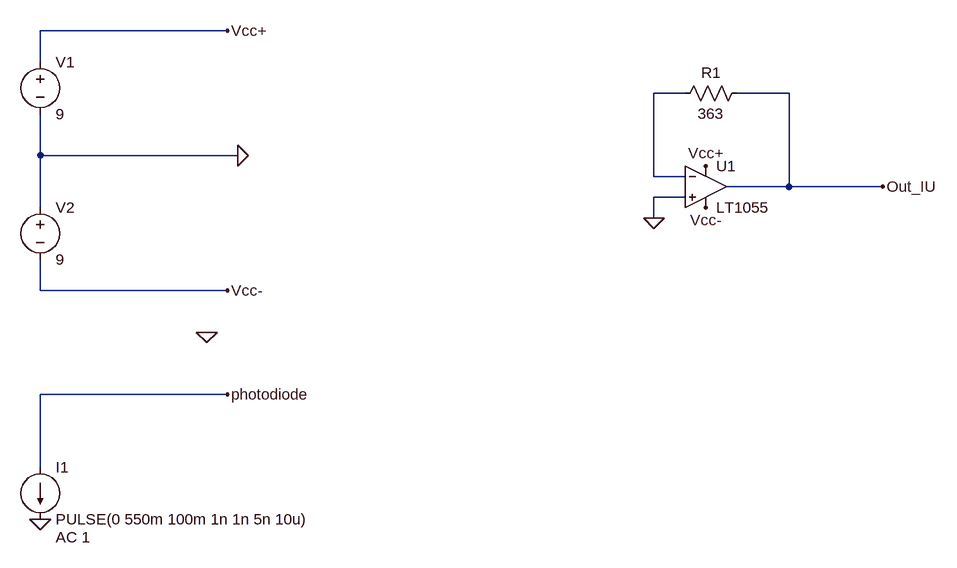
[diagram p0: schematic adaptation_d_impedance_seule.asc]
adaptation_d_impedance_seule.asc, the LTspice schematic file:
Version 4
SHEET 1 1144 680
WIRE 32 -464 -256 -464
WIRE -256 -416 -256 -464
WIRE 736 -368 688 -368
WIRE 896 -368 816 -368
WIRE -256 -272 -256 -336
WIRE 48 -272 -256 -272
WIRE 688 -240 688 -368
WIRE 736 -240 688 -240
WIRE 896 -224 896 -368
WIRE 896 -224 800 -224
WIRE 1040 -224 896 -224
WIRE 736 -208 688 -208
WIRE -256 -192 -256 -272
WIRE 688 -176 688 -208
WIRE -256 -64 -256 -112
WIRE 32 -64 -256 -64
WIRE 32 96 -256 96
WIRE -256 208 -256 96
FLAG 32 96 photodiode
FLAG -256 288 0
FLAG 32 -464 Vcc+
FLAG 32 -64 Vcc-
FLAG 48 -272 0
FLAG 768 -256 Vcc+
FLAG 768 -192 Vcc-
FLAG 1040 -224 Out_IU
FLAG 688 -176 0
FLAG 0 0 0
SYMBOL current -256 208 R0
WINDOW 123 24 108 Left 2
WINDOW 39 0 0 Left 0
SYMATTR Value2 AC 1
SYMATTR InstName I1
SYMATTR Value PULSE(0 550m 100m 1n 1n 5n 10u)
SYMBOL voltage -256 -432 R0
WINDOW 123 0 0 Left 0
WINDOW 39 0 0 Left 0
SYMATTR InstName V1
SYMATTR Value 9
SYMBOL voltage -256 -208 R0
WINDOW 123 0 0 Left 0
WINDOW 39 0 0 Left 0
SYMATTR InstName V2
SYMATTR Value 9
SYMBOL OpAmps\\LT1055 768 -288 R0
SYMATTR InstName U1
SYMBOL res 832 -384 R90
WINDOW 0 0 56 VBottom 2
WINDOW 3 32 56 VTop 2
SYMATTR InstName R1
SYMATTR Value 363

The netlist it stands for:
* adaptation_d_impedance_seule.asc
I1 photodiode 0 PULSE(0 550m 100m 1n 1n 5n 10u) AC 1
V1 Vcc+ 0 9
V2 0 Vcc- 9
XU1 0 N001 Vcc+ Vcc- Out_IU LT1055  ; pins In+ In- V+ V- OUT
R1 Out_IU N001 363
.backanno
.end